# Altium schematic sheet SIM_Socket.SchDoc: SIM Tray
size 292 x 193 mm; SheetNumber: 7; SheetTotal: 9
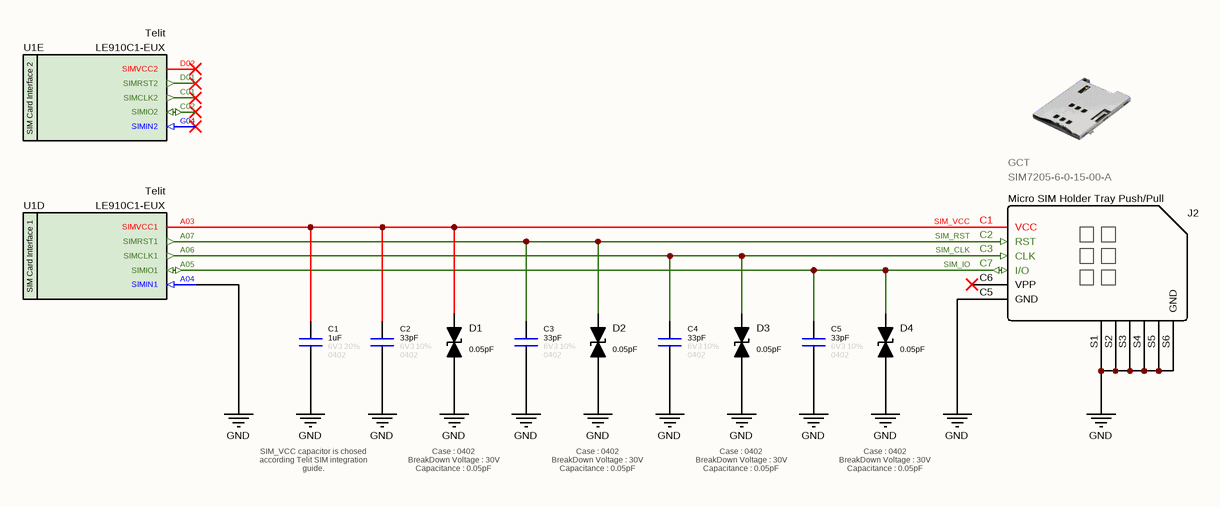
[diagram p0: SIM_Socket.SchDoc]

## Parts
C1  value 1uF  Tolerance: 20%  Case: 0402  Voltage: 6V3  [CAPACITOR_0402]  (hidden comment: Capacitor - 1uF [0402] (Ceramic))
C2  value 33pF  Tolerance: 10%  Case: 0402  Voltage: 6V3  [CAPACITOR_0402]  (hidden comment: Capacitor - 33pF [0402] (Ceramic))
C3  value 33pF  Tolerance: 10%  Case: 0402  Voltage: 6V3  [CAPACITOR_0402]  (hidden comment: Capacitor - 33pF [0402] (Ceramic))
C4  value 33pF  Tolerance: 10%  Case: 0402  Voltage: 6V3  [CAPACITOR_0402]  (hidden comment: Capacitor - 33pF [0402] (Ceramic))
C5  value 33pF  Tolerance: 10%  Case: 0402  Voltage: 6V3  [CAPACITOR_0402]  (hidden comment: Capacitor - 33pF [0402] (Ceramic))
D1  Capacitance: 0.05pF  [INDUCTOR_0402]  (hidden comment: 0402ESDA-MLP1)
D2  Capacitance: 0.05pF  [INDUCTOR_0402]  (hidden comment: 0402ESDA-MLP1)
D3  Capacitance: 0.05pF  [INDUCTOR_0402]  (hidden comment: 0402ESDA-MLP1)
D4  Capacitance: 0.05pF  [INDUCTOR_0402]  (hidden comment: 0402ESDA-MLP1)
J2  Card Type: Micro SIM Holder Tray Push/Pull  Manufacturer Name: GCT  [CONNECTOR - Micro SIM Card]  (hidden comment: SIM7205-6-0-15-00-A)
U1  Manufacturer Part Number: LE910C1-EUX  Manufacturer Name: Telit  [LE910 GSM Modem]  (hidden comment: LE910C1-EUX LTE GSM Module)  (parts D,E of 19)

## Nets
GND: C1.1 C2.1 C3.1 C4.1 C5.1 D1.2(GND) D2.2(GND) D3.2(GND) D4.2(GND) J2.C5(GND) J2.S1(GND) J2.S2(GND) J2.S3(GND) J2.S4(GND) J2.S5(GND) J2.S6(GND) U1.A04(SIMIN1)
SIM_CLK: C4.2 D3.1(I/O) J2.C3(CLK) U1.A06(SIMCLK1)
SIM_IO: C5.2 D4.1(I/O) J2.C7(I/O) U1.A05(SIMIO1)
SIM_RST: C3.2 D2.1(I/O) J2.C2(RST) U1.A07(SIMRST1)
SIM_VCC: C1.2 C2.2 D1.1(I/O) J2.C1(VCC) U1.A03(SIMVCC1)

Not connected (* = marked no-connect by the designer): J2 C6(VPP)*; U1 C01(SIMCLK2)* C02(SIMIO2)* D01(SIMRST2)* D02(SIMVCC2)* G04(SIMIN2)*

## Notes on the sheet
- SIM_VCC capacitor is chosed according Telit SIM integration guide.
- Case : 0402
  BreakDown Voltage : 30V
  Capacitance : 0.05pF
- © 2026 All rights reserved.
  This document may not, in whole or in part, be copied, photocopied, reproduced, translated or converted to any electronic or machine readable from without prior written permission of Mehmet Günce Akkoyun.
  Engineer contact : akkoyun@me.com
- Property of
- Engineer :
- Date :
- Size :
- A4
- Time :
- Project :
- Page :
- /
- Customer :
- Product ID :
- Module ID :
- Version :
- File :
- Revision :
- (in symbol IC - LE910C1-EUX, part D) SIM Card Interface 1
- (in symbol IC - LE910C1-EUX, part E) SIM Card Interface 2

## Library data of the parts
C1 = Capacitor - 1uF [0402-6V3]: Multilayer Ceramic Capacitors - SMD - 6.3V 1uF X5R 0402 20%; Manufacturer Part Number: GRM153R60J105ME95D; Manufacturer Name: Murata
C2-C5 = Capacitor - 33pF [0402-6V3]: Manufacturer Name: Kemet; Manufacturer Part Number: C0402C330J9RACAUTO; ComponentLink1Description: DataSheet; ComponentLink1URL: https://api.kemet.com/component-edge/download/datasheet/C0402C330J9RACAUTO.pdf; ComponentLink2Description: Mouser; ComponentLink2URL: https://www.mouser.com/Search/Refine.aspx?Keyword=80-C0402C330J9RAUTO
D1-D4 = Diode - 0402ESDA-MLP1 (ESD): ESD Protection Diodes / TVS Diodes PolySurg 0402 35V .05pF; Manufacturer Name: Eaton; Breakdown Voltage: 30V; Case: 0402; Manufacturer Part Number: 0402ESDA-MLP1
J2 = Connector - Sim Holder (Micro SIM): Memory Card Connectors Micro SIM Push-Pull, 6P, SMT, 1.48mm Profile, No Peg, Without switch, T&R; Manufacturer Part Number: SIM7205-6-0-15-00-A
U1 = IC - LE910C1-EUX: Telit LE910C1-EUX LTE/2G GSM Module; Case: BGA